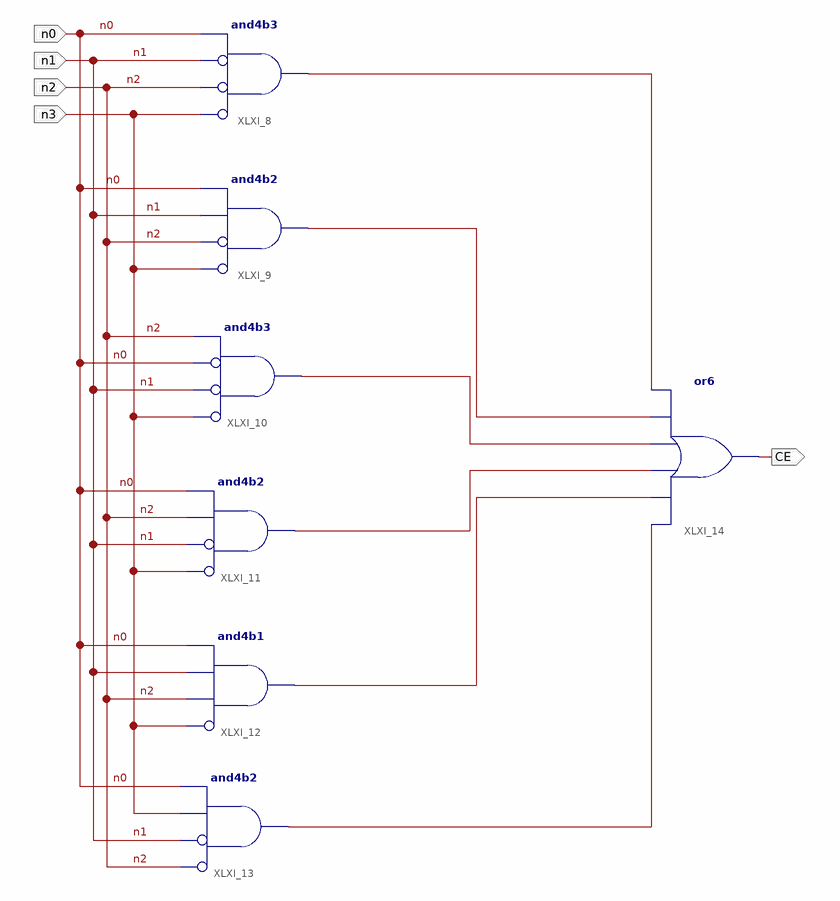
[diagram p0: schematic sheet 1]
// Xilinx ISE schematic E.sch (spartan3e) as structural Verilog: 7 symbols, 5 ports
module E (
  input  n0,
  input  n1,
  input  n2,
  input  n3,
  output CE
);

  wire XLXN_2, XLXN_3, XLXN_4, XLXN_5, XLXN_6, XLXN_7;

  and XLXI_8 (XLXN_2, ~n3, ~n2, ~n1, n0);  // and4b3
  and XLXI_9 (XLXN_3, ~n3, ~n2, n1, n0);  // and4b2
  and XLXI_10 (XLXN_4, ~n3, ~n1, ~n0, n2);  // and4b3
  and XLXI_11 (XLXN_5, ~n3, ~n1, n2, n0);  // and4b2
  and XLXI_12 (XLXN_6, ~n3, n2, n1, n0);  // and4b1
  and XLXI_13 (XLXN_7, ~n2, ~n1, n3, n0);  // and4b2
  or XLXI_14 (CE, XLXN_7, XLXN_6, XLXN_5, XLXN_4, XLXN_3, XLXN_2);
endmodule
